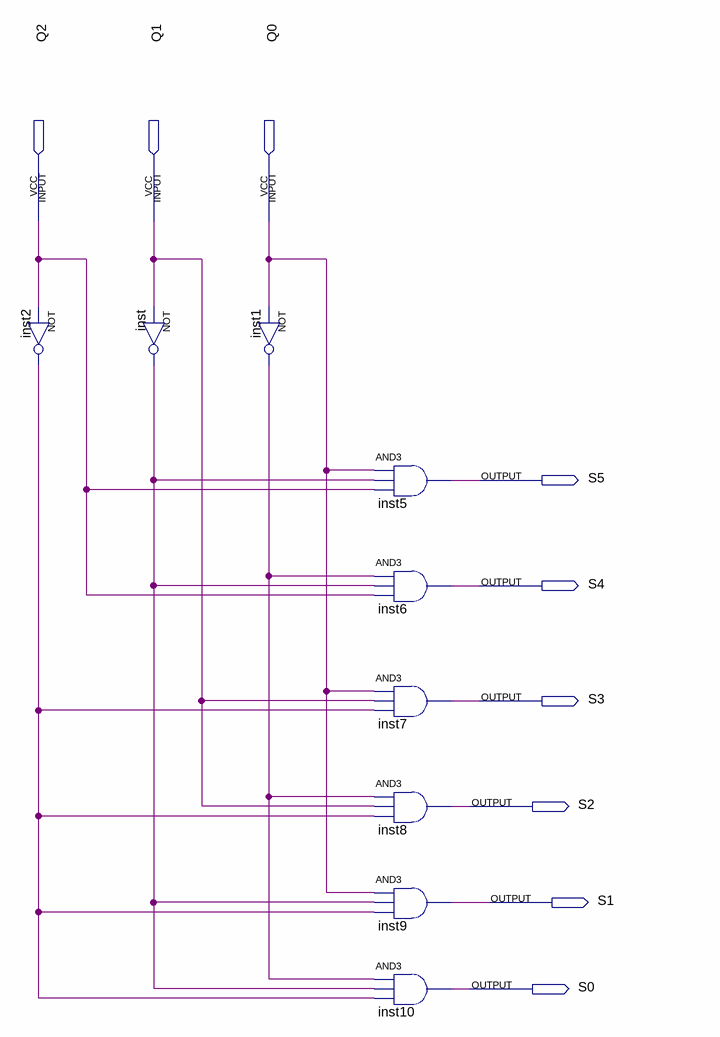
[diagram p0: schematic sheet]
// Quartus schematic lab2.bdf as structural Verilog: 9 symbols, 9 pins
module lab2 (
  input  Q2,
  input  Q1,
  input  Q0,
  output S5,
  output S4,
  output S3,
  output S2,
  output S1,
  output S0
);

  wire inst1_out, inst2_out, inst_out;

  not inst2 (inst2_out, Q2);
  not inst (inst_out, Q1);
  not inst1 (inst1_out, Q0);
  and inst5 (S5, Q0, inst_out, Q2);
  and inst6 (S4, inst1_out, inst_out, Q2);
  and inst7 (S3, Q0, Q1, inst2_out);
  and inst8 (S2, inst1_out, Q1, inst2_out);
  and inst9 (S1, Q0, inst_out, inst2_out);
  and inst10 (S0, inst1_out, inst_out, inst2_out);
endmodule
